# EAGLE design rgb (EAGLE 6.1)
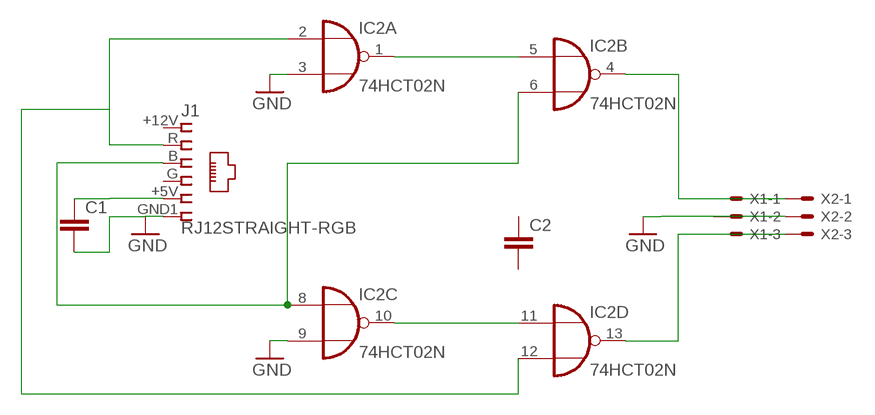
[diagram p0: schematic, sheet 1]

## Parts
C1  C-EU025-025X050  [C025-025X050]
C2  C-EU025-025X050  [C025-025X050]
IC2  74HCT02N  [DIL14]
J1  RJ12STRAIGHT-RGB  [RJ12-STRAIGHT-RGB]
X1  KK-156-3  [KK-156-3]
X2  KK-156-3  [KK-156-3]

## Nets
GND: C1.2 IC2.3(A:I1) IC2.9(C:I1) J1.GND1 X1.2 X2.2
N$1: IC2.2(A:I0) IC2.12(D:I1) J1.R
N$2: IC2.6(B:I1) IC2.8(C:I0) J1.B
N$3: IC2.1(A:O) IC2.5(B:I0)
N$4: IC2.10(C:O) IC2.11(D:I0)
N$6: IC2.4(B:O) X1.1 X2.1
N$7: IC2.13(D:O) X1.3 X2.3
VCC: C1.1 J1.+5V
Unconnected: C2.1 C2.2

## Power pins joined to a net without a drawn wire
1: J1.+12V
4: J1.G
GND: IC2.7(P:GND)
VCC: IC2.14(P:VCC)

## Library data of the parts
C1 C2 = rcl:C-EU: CAPACITOR, European symbol
IC2 = 74xx-eu:74*02: Quad 2-input NOR gate
J1 = lpatiny:RJ12: CORCOM Modular RJ Jacks No Shield Source: www.tycoelectronics.com .. ENG_DS_1654001_1099_RJ_L_0507.pdf
X1 X2 = con-molex:KK-156-3: KK 156 HEADER Source: http://www.molex.com/pdm_docs/sd/026604100_sd.pdf; OC_FARNELL: unknown; OC_NEWARK: unknown

## Net classes
0 default: width 0.508 mm

## Board
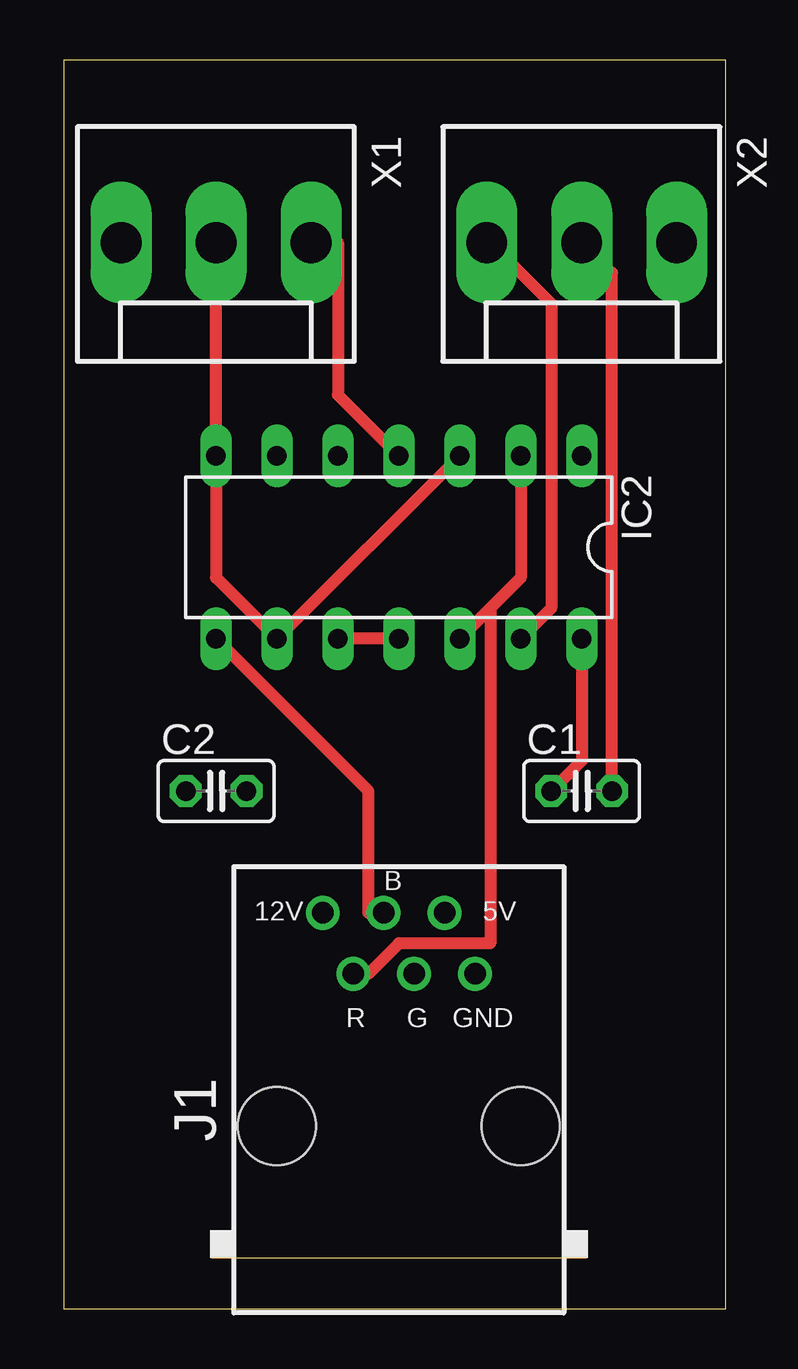
[diagram p1: board, top side]
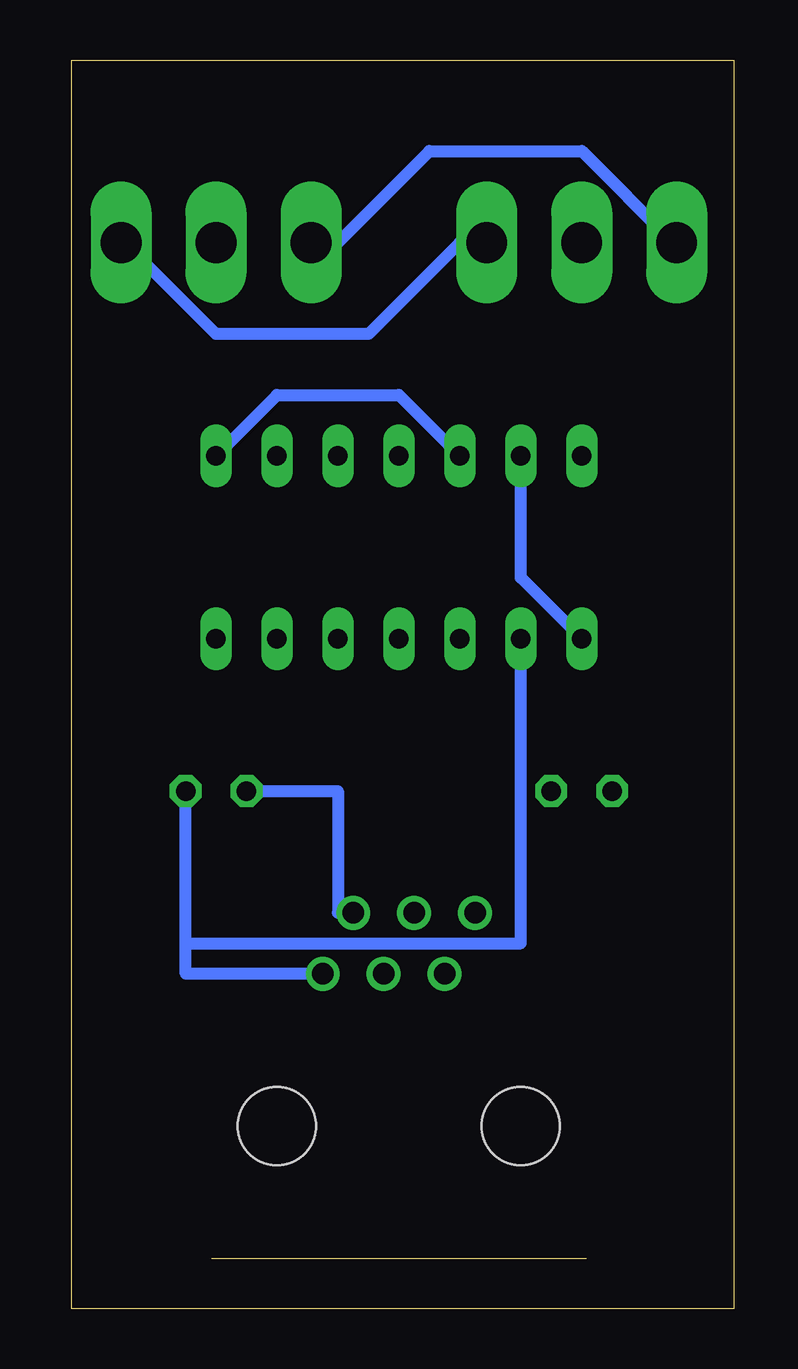
[diagram p2: board, bottom side, seen from below]

Size 27.61 x 52.06 mm. Coordinates in mm from the lower left corner, seen from the top.
Outline: 0,0 27.61,0 27.61,52.06 0,52.06 0,0
Copper layers (1*16): Top 0.035mm / dielectric 1.5mm / Bottom 0.035mm
Design rules: minimum track width 10mil, minimum drill 24mil, track to track 8mil, track to pad 8mil, pad to pad 8mil, via to via 8mil, smd to smd 8mil, copper to edge 40mil, drill to drill 8mil, minimum pad ring 10mil, minimum via ring 8mil, stop-mask expansion 4mil, vias tented up to drill 0mil, thermal gap 10mil

### Footprints (pad centres in the part's own frame; a part is rotated, then mirrored left to right if it is on the bottom)
C025-025X050 = drill 0.813 octagon: 1 -1.27,0; 2 1.27,0
DIL14 = drill 0.813 long: 1 -7.62,-3.81; 2 -5.08,-3.81; 3 -2.54,-3.81; 4 0,-3.81; 5 2.54,-3.81; 6 5.08,-3.81; 7 7.62,-3.81; 8 7.62,3.81; 9 5.08,3.81; 10 2.54,3.81; 11 0,3.81; 12 -2.54,3.81; 13 -5.08,3.81; 14 -7.62,3.81
RJ12-STRAIGHT-RGB = drill 0.9 pad 1.4: +5V 1.905,8.89; +12V -3.175,8.89; B -0.635,8.89; G 0.635,6.35; GND1 3.175,6.35; R -1.905,6.35 | hole 3.251: -5.08,0; 5.08,0
KK-156-3 = drill 1.7 pad 2.184 long: 1 -3.96,0; 2 0,0; 3 3.96,0

### Placement (x,y rotation side)
C1  21.59,21.59 0 top
C2  6.35,21.59 0 top
IC2  13.97,31.75 180 top
J1  13.97,7.62 0 top
X1  6.35,44.45 180 top
X2  21.59,44.45 180 top

### Tracks (layer width: path | path; a pad name or v marks a point on that pad's centre or on a via)
GND
  Top 0.508: IC2.3 IC2.9 6.35,30.48 IC2.7 X1.2 | X2.2 22.86,43.18 C1.2
  Bottom 0.508: 22.86,15.24 22.86,13.97 17.78,13.97 J1.GND1 | 22.86,15.24 C1.2 | IC2.9 8.89,15.24 22.86,15.24
N$1
  Top 0.508: 17.78,29.21 19.05,30.48 IC2.2 | 17.78,29.21 IC2.12 | 17.78,29.21 17.78,15.24 13.97,15.24 12.7,13.97 J1.R
N$2
  Top 0.508: IC2.8 12.7,21.59 12.7,16.51 J1.B
  Bottom 0.508: IC2.6 8.89,30.48 IC2.8
N$3
  Bottom 0.508: IC2.5 13.97,38.1 19.05,38.1 IC2.1
N$4
  Top 0.508: IC2.11 IC2.10
N$6
  Top 0.508: IC2.4 11.43,38.1 11.43,44.45 X1.1
  Bottom 0.508: X2.1 25.4,44.45 21.59,40.64 15.24,40.64 11.43,44.45 X1.1
N$7
  Top 0.508: IC2.13 20.32,29.21 20.32,41.91 17.78,44.45 X2.3
  Bottom 0.508: X1.3 2.54,44.45 6.35,48.26 12.7,48.26 16.51,44.45 X2.3
VCC
  Top 0.508: C1.1 21.59,22.86 IC2.14
  Bottom 0.508: C1.1 16.51,21.59 16.51,16.51 J1.+5V